# EasyEDA Pro project desk buddy.eprj

# Board PCB1
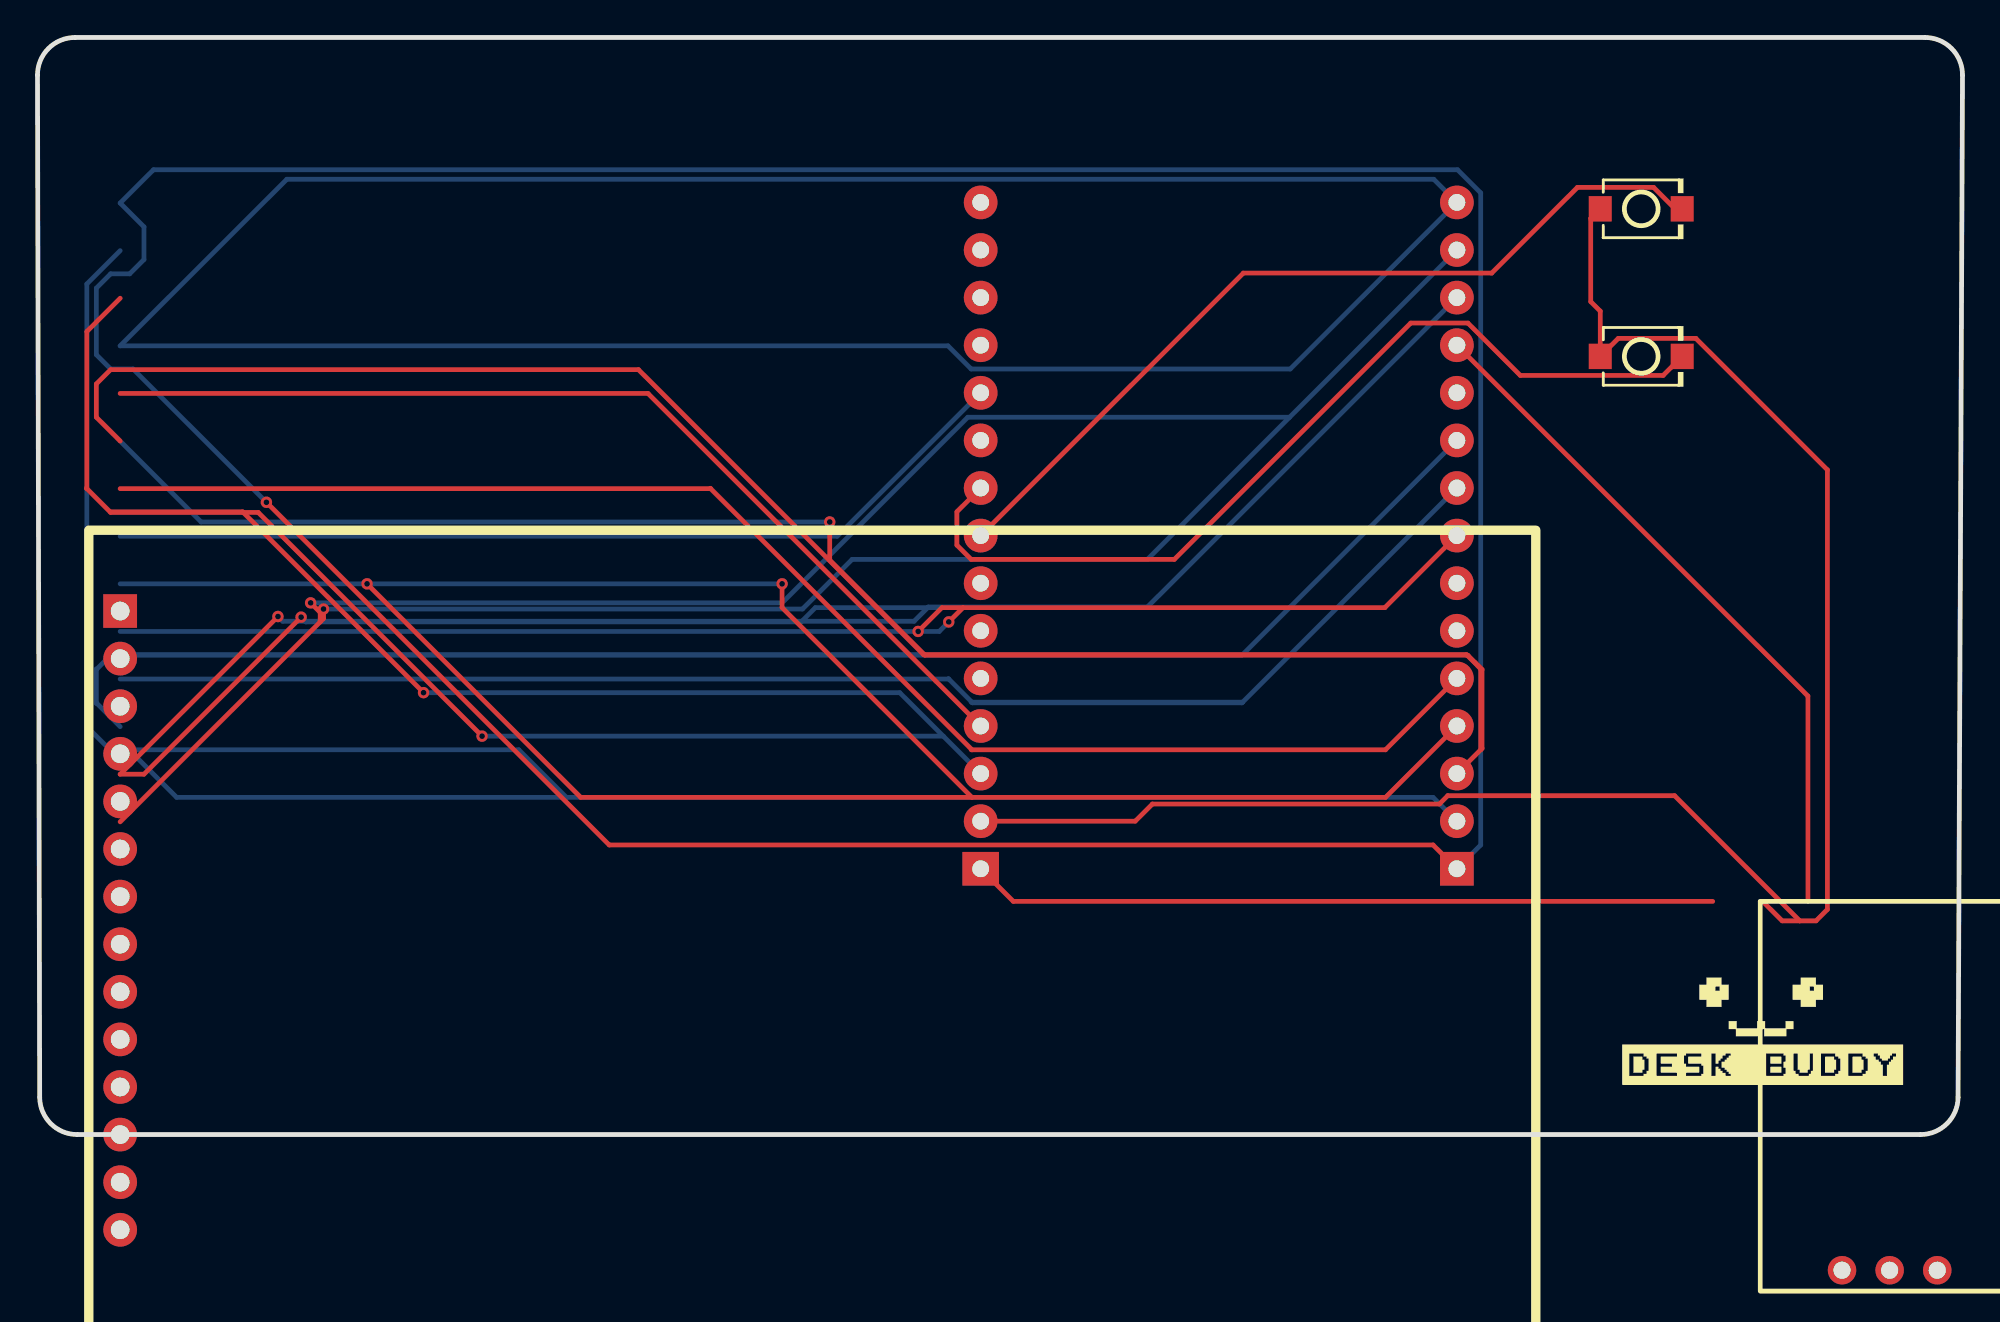
[diagram p0: board, top side]
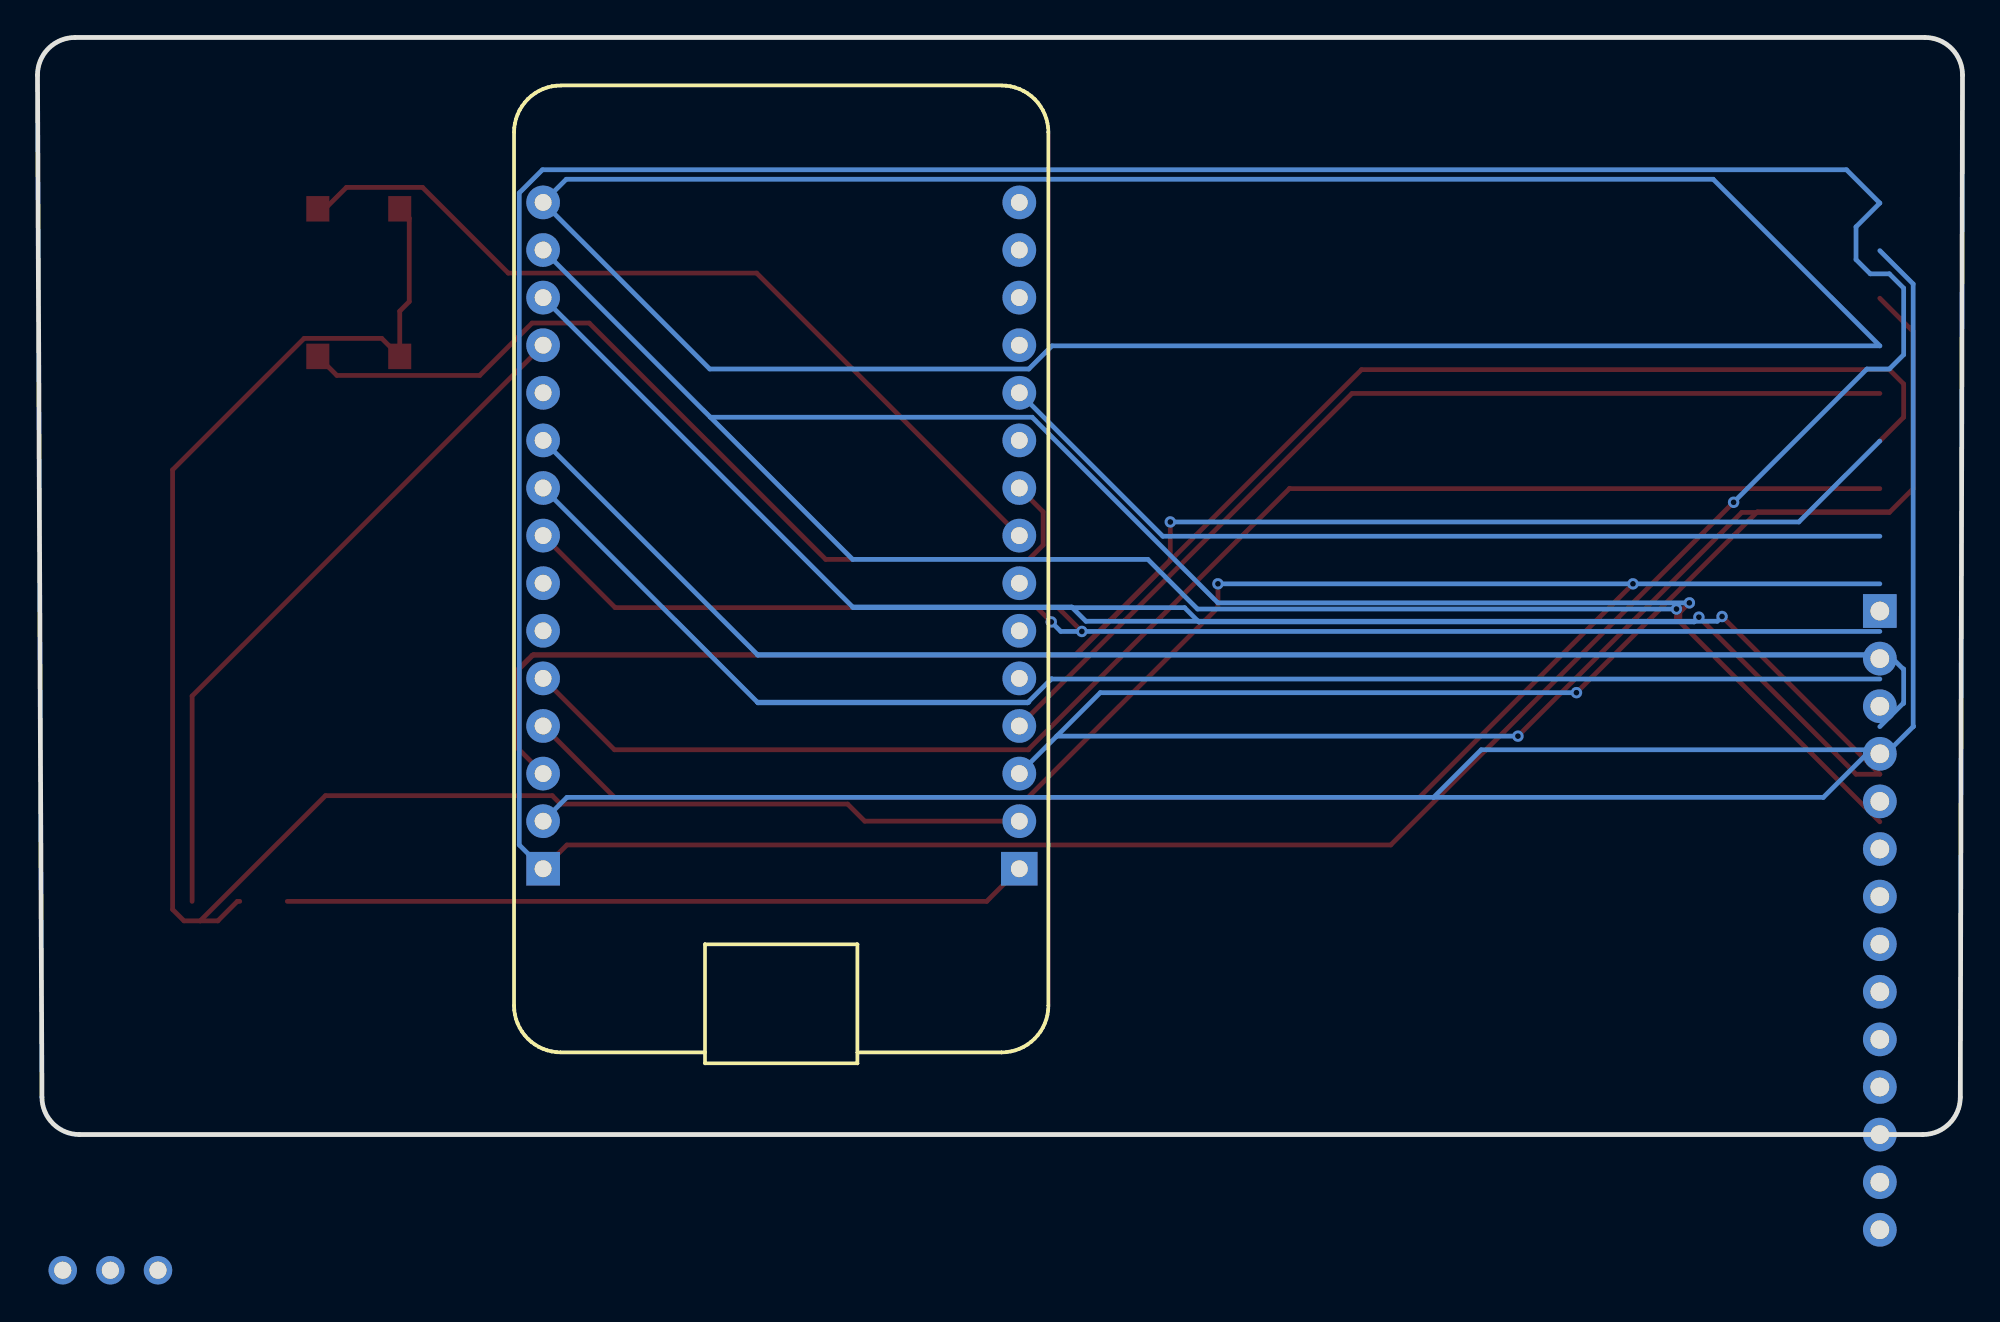
[diagram p1: board, bottom side, seen from below]

Outline 102.68 x 58.54 mm; copper layers: Top Layer, Bottom Layer. Coordinates in mm from the lower left corner of the outline.
Outline path: 0,56.54 0.12,2 arc(0.7,0.58) 2.12,0 100.44,0 arc(101.85,0.58) 102.44,1.99 102.68,56.54 arc(102.1,57.96) 100.68,58.54 2,58.54 arc(0.58,57.96) 0,56.54
Stack: Top Layer 0.035mm / Dielectric1 1.51mm FR4 er 4.5 / Bottom Layer 0.035mm

## Design rules (mm)
template: JLCPCB Capability(Two Layers Board)
spacing copperThickness1oz (default): track to track 0.102, other pairs 0.152 to 0.3
spacing copperThickness2oz: track to track 0.203, other pairs 0.152 to 0.3
track width copperThickness1oz (default): min 0.127, default 0.254, max 2.54
track width copperThickness2oz: min 0.203, default 0.254, max 2.54
differential pair differentialPair (default): width min 0.127, default 0.254, max 2.54; gap min 0.152, default 0.152
via viaSize (default): diameter min 0.5, default 0.61, max 10; hole min 0.3, default 0.305, max 6.3

## Placement (name value [footprint] x y rotation side)
DISPLAYILI9341TOUCH2.4IN  -  [display_ili9341_touch_2.4in_version2]  2.74 11.3 0 top
SW1  TS-1088-AR02016  [SW-SMD_L3.9-W3.0-P4.45]  85.54 49.4 0 top
SW2  TS-1088-AR02016  [SW-SMD_L3.9-W3.0-P4.45]  85.54 41.53 0 top
U1  ESP32 DEVKITV1  [ESP32 DEVELOPMENT KIT V1]  63.01 31.96 180 bottom
U2  -  [Max4466]  91.89 12.44 0 top

## Footprints (pads in the part's own frame, mm; a bottom-side part is the same pattern mirrored in y, then rotated)
display_ili9341_touch_2.4in_version2
  rect 1.8x1.8 hole 1: 1(1.672,16.637)
  round 1.8 hole 1: 2(1.672,14.097) 3(1.672,11.557) 4(1.672,9.017) 5(1.672,6.477) 6(1.672,3.937) 7(1.672,1.397) 8(1.672,-1.143) 9(1.672,-3.683) 10(1.672,-6.223) 11(1.672,-8.763) 12(1.672,-11.303) 13(1.672,-13.843) 14(1.672,-16.383)
ESP32 DEVELOPMENT KIT V1
  rect 1.95x1.8 hole 0.9: 3v3(12.7,-17.78)
  round 1.8 hole 0.9: D2(12.7,-10.16) D4(12.7,-7.62) D5(12.7,0) D12(-12.7,-10.16) D13(-12.7,-12.7) D14(-12.7,-7.62) D15(12.7,-12.7) D18(12.7,2.54) D19(12.7,5.08) D21(12.7,7.62) D22(12.7,15.24) D23(12.7,17.78) D25(-12.7,0) D26(-12.7,-2.54) D27(-12.7,-5.08) D32(-12.7,5.08) D33(-12.7,2.54) D34(-12.7,10.16) D35(-12.7,7.62) EN(-12.7,17.78) GND#1(12.7,-15.24) GND#2(-12.7,-15.24) RX0(12.7,10.16) RX2(12.7,-5.08) TX0(12.7,12.7) TX2(12.7,-2.54) VN(-12.7,12.7) VP(-12.7,15.24)
  rect 1.8x1.8 hole 0.9: Vin(-12.7,-17.78)
Max4466
  round 1.524 hole 0.914: 1(4.36,-19.685) 2(6.9,-19.685) 3(9.44,-19.685)
SW-SMD_L3.9-W3.0-P4.45
  rect 1.23x1.36 smd: 1(-2.185,0) 2(2.185,0)

## Nets
$1N1195: DISPLAYILI9341TOUCH2.4IN.1 U1.Vin
$1N1201: DISPLAYILI9341TOUCH2.4IN.2 U1.GND#2
$1N1205: U1.3v3 U2.1
$1N1211: SW1.1 SW2.1 U1.GND#1 U2.2
$1N1253: SW1.2 U1.D5
$1N1260: SW2.2 U1.D18
$1N1267: DISPLAYILI9341TOUCH2.4IN.3 U1.D15
$1N1281: DISPLAYILI9341TOUCH2.4IN.4 U1.EN
$1N1330: DISPLAYILI9341TOUCH2.4IN.5 U1.D2
$1N1343: DISPLAYILI9341TOUCH2.4IN.6 U1.D13
$1N1350: DISPLAYILI9341TOUCH2.4IN.7 U1.D14
$1N1357: DISPLAYILI9341TOUCH2.4IN.8 U1.D21
$1N1369: DISPLAYILI9341TOUCH2.4IN.9 U1.D12
$1N1381: DISPLAYILI9341TOUCH2.4IN.10 U1.D25
$1N1390: DISPLAYILI9341TOUCH2.4IN.11 U1.D33
$1N1404: DISPLAYILI9341TOUCH2.4IN.12 U1.D32
$1N1413: U1.D34 U2.3
$1N1443: DISPLAYILI9341TOUCH2.4IN.13 U1.VN
$1N1447: DISPLAYILI9341TOUCH2.4IN.14 U1.VP

Pads without a net: U1 D4 D19 D22 D23 D26 D27 D35 RX0 RX2 TX0 TX2

## Via types
v1: diameter 0.61, hole 0.305, Top Layer to Bottom Layer, 12 vias

## Routing (per net, layer and track width the routed paths; a pad name or vN(x,y) marks a point on that pad's centre or on a via; arc(x,y) is an arc through that point)
$1N1195: length 204.6
  Top Layer w0.254: U1.Vin 74.44,15.45 30.5,15.45 v1(12.21,33.74)
  Bottom Layer w0.254: U1.Vin 76.98,15.45 76.98,50.25 75.74,51.49 6.19,51.49 4.41,49.71 5.68,48.44 5.68,46.69 4.92,45.93 3.9,45.93 3.14,45.17 3.14,41.61 3.9,40.85 5.1,40.85 v1(12.21,33.74)
$1N1201: length 126.7
  Bottom Layer w0.254: 2.63,21.77 2.63,45.39 4.41,47.17 ; 2.63,21.77 3.9,20.5 4.92,20.5 7.42,17.99 28.21,17.99 ; 2.63,21.77 2.61,21.78 ; 3.9,20.53 25.67,20.53 28.21,17.99 ; U1.GND#2 74.44,17.99 28.21,17.99
$1N1205: length 39.8
  Top Layer w0.254: 89.35,12.44 52.05,12.44 U1.3v3
$1N1211: length 98.5
  Top Layer w0.254: 94,11.4 93.06,11.4 92.02,12.44 91.89,12.44 ; 94,11.4 87.32,18.08 75.22,18.08 74.77,17.64 59.47,17.64 58.55,16.72 U1.GND#1 ; 94,11.4 94.86,11.4 95.47,12.01 95.47,35.47 88.46,42.48 84.32,42.48 SW2.1 83.36,43.94 82.85,44.45 82.85,48.89 SW1.1
$1N1253: length 45
  Top Layer w0.254: 87.22,49.53 86.2,50.54 82.14,50.54 77.57,45.97 64.32,45.97 U1.D5
$1N1260: length 49.4
  Top Layer w0.254: U1.D18 49.04,33.23 49.04,31.45 49.8,30.69 60.64,30.69 73.25,43.3 76.3,43.3 79.09,40.51 86.71,40.51 SW2.2
$1N1267: length 114.3
  Top Layer w0.254: 10.97,33.2 10.94,33.23 3.9,33.23 ; 10.97,33.2 v1(20.59,23.58) ; 10.97,33.2 11.78,33.2 v1(23.71,21.26) ; 10.97,33.2 3.9,33.2 2.63,34.47 ; 4.41,44.63 2.63,42.85 2.63,34.47 ; 2.63,34.47 2.61,34.48
  Bottom Layer w0.254: U1.D15 48.31,21.26 ; 48.31,21.26 45.99,23.58 v1(20.59,23.58) ; 48.31,21.26 v1(23.71,21.26)
$1N1281: length 151
  Bottom Layer w0.254: U1.EN 66.82,40.85 49.8,40.85 48.57,42.09 4.41,42.09 13.3,50.98 74.47,50.98 U1.EN
$1N1330: length 53.3
  Top Layer w0.254: U1.D2 32.56,39.55 4.41,39.55
$1N1343: length 173.7
  Top Layer w0.254: 76.25,25.58 76.29,25.58 77.05,24.82 77.05,20.61 76.98,20.53 ; 76.25,25.58 76.22,25.61 47.3,25.61 ; 76.25,25.58 76.98,24.85 76.98,20.53 ; 76.25,25.58 47.34,25.58 47.3,25.61 ; 76.98,20.53 U1.D13 ; 47.3,25.61 47.26,25.61 32.06,40.82 3.9,40.82 3.14,40.06 3.14,38.28 4.41,37.01 ; 47.3,25.61 42.26,30.66 v1(42.26,32.69)
  Bottom Layer w0.254: 4.41,37.01 8.73,32.69 v1(42.26,32.69)
$1N1350: length 78.7
  Top Layer w0.254: U1.D14 71.9,20.53 49.84,20.53 ; 49.84,20.53 49.8,20.53 ; 49.84,20.53 35.91,34.47 ; 35.91,34.47 35.89,34.49 ; 35.91,34.47 4.41,34.47
$1N1357: length 49.1
  Bottom Layer w0.254: 4.41,31.93 42.66,31.93 U1.D21
$1N1369: length 115.3
  Top Layer w0.254: v1(17.58,29.39) 28.97,17.99 49.84,17.99 ; U1.D12 71.9,17.99 49.84,17.99 ; v1(39.72,29.39) 39.72,28.12 49.84,17.99
  Bottom Layer w0.254: 4.41,29.39 v1(17.58,29.39) v1(39.72,29.39)
$1N1381: length 76.3
  Top Layer w0.254: v1(46.97,26.85) 48.24,28.12 49.37,28.12 ; U1.D25 71.87,28.12 49.37,28.12 ; 49.37,28.12 v1(48.61,27.36)
  Bottom Layer w0.254: 4.41,26.85 v1(46.97,26.85) 48.1,26.85 v1(48.61,27.36)
$1N1390: length 91.1
  Bottom Layer w0.254: 64.28,23.07 49.84,23.07 ; 64.28,23.07 64.25,23.04 49.88,23.04 49.84,23.07 ; 64.28,23.07 U1.D33 ; 49.84,23.07 49.8,23.07 ; 49.84,23.07 48.61,24.31 ; 4.41,24.31 48.61,24.31 ; 48.61,24.31 48.59,24.33
$1N1404: length 141.7
  Bottom Layer w0.254: 64.28,25.61 64.25,25.58 3.9,25.58 ; 64.28,25.61 U1.D32 ; 64.28,25.61 3.94,25.61 3.9,25.58 ; 3.9,25.58 3.14,24.82 ; 3.14,23.04 3.14,24.82 ; 3.14,23.04 4.41,21.77 ; 3.14,23.04 3.14,23 ; 3.14,24.82 3.14,24.85
$1N1413: length 37.4
  Top Layer w0.254: 94.43,12.44 94.43,23.4 U1.D34
$1N1443: length 140.7
  Top Layer w0.254: v1(12.83,27.64) 4.41,19.23 5.68,19.23 v1(14.06,27.61)
  Bottom Layer w0.254: v1(14.06,27.61) 14.28,27.39 ; 14.28,27.39 40.77,27.39 ; 14.28,27.39 14.32,27.36 40.73,27.36 40.77,27.39 ; 14.28,27.39 13.08,27.39 v1(12.83,27.64) ; 40.77,27.39 41.49,28.12 47.48,28.12 ; 40.77,27.39 46.75,27.39 47.48,28.12 ; 47.48,28.12 59.17,28.12 59.2,28.15 ; 47.48,28.12 47.52,28.15 59.2,28.15 ; 59.2,28.15 U1.VN
$1N1447: length 141.8
  Top Layer w0.254: v1(15.26,28.04) 15.26,27.54 15.08,27.36 ; 15.08,27.36 15.08,27.86 v1(14.57,28.37) ; 15.08,27.36 4.41,16.69
  Bottom Layer w0.254: U1.VP 66.79,38.28 ; 66.79,38.28 49.62,38.28 39.72,28.37 v1(14.57,28.37) ; 66.79,38.28 59.2,30.69 43.45,30.69 40.8,28.04 v1(15.26,28.04)
